# Altium schematic sheet Drive.SchDoc
size 420 x 297 mm; DocumentNumber: 2; SheetNumber: 2; SheetTotal: 6; PageSetup: Record=PageOptions|CenterHorizontal=True|CenterVertical=True|PrintScale=0.96|XCorrection=1.00|YCorrection=1.00|PrintKind=1|BorderSize=5000000|LeftOffset=0|BottomOffset=0|Orientation=2|PaperLength=4318|PaperWidth=2794|Scale=100|PaperSource=7|PrintQuality=600|MediaType=1|DitherType=10|PaperKind=11" x 17"|PrintScaleMode=1
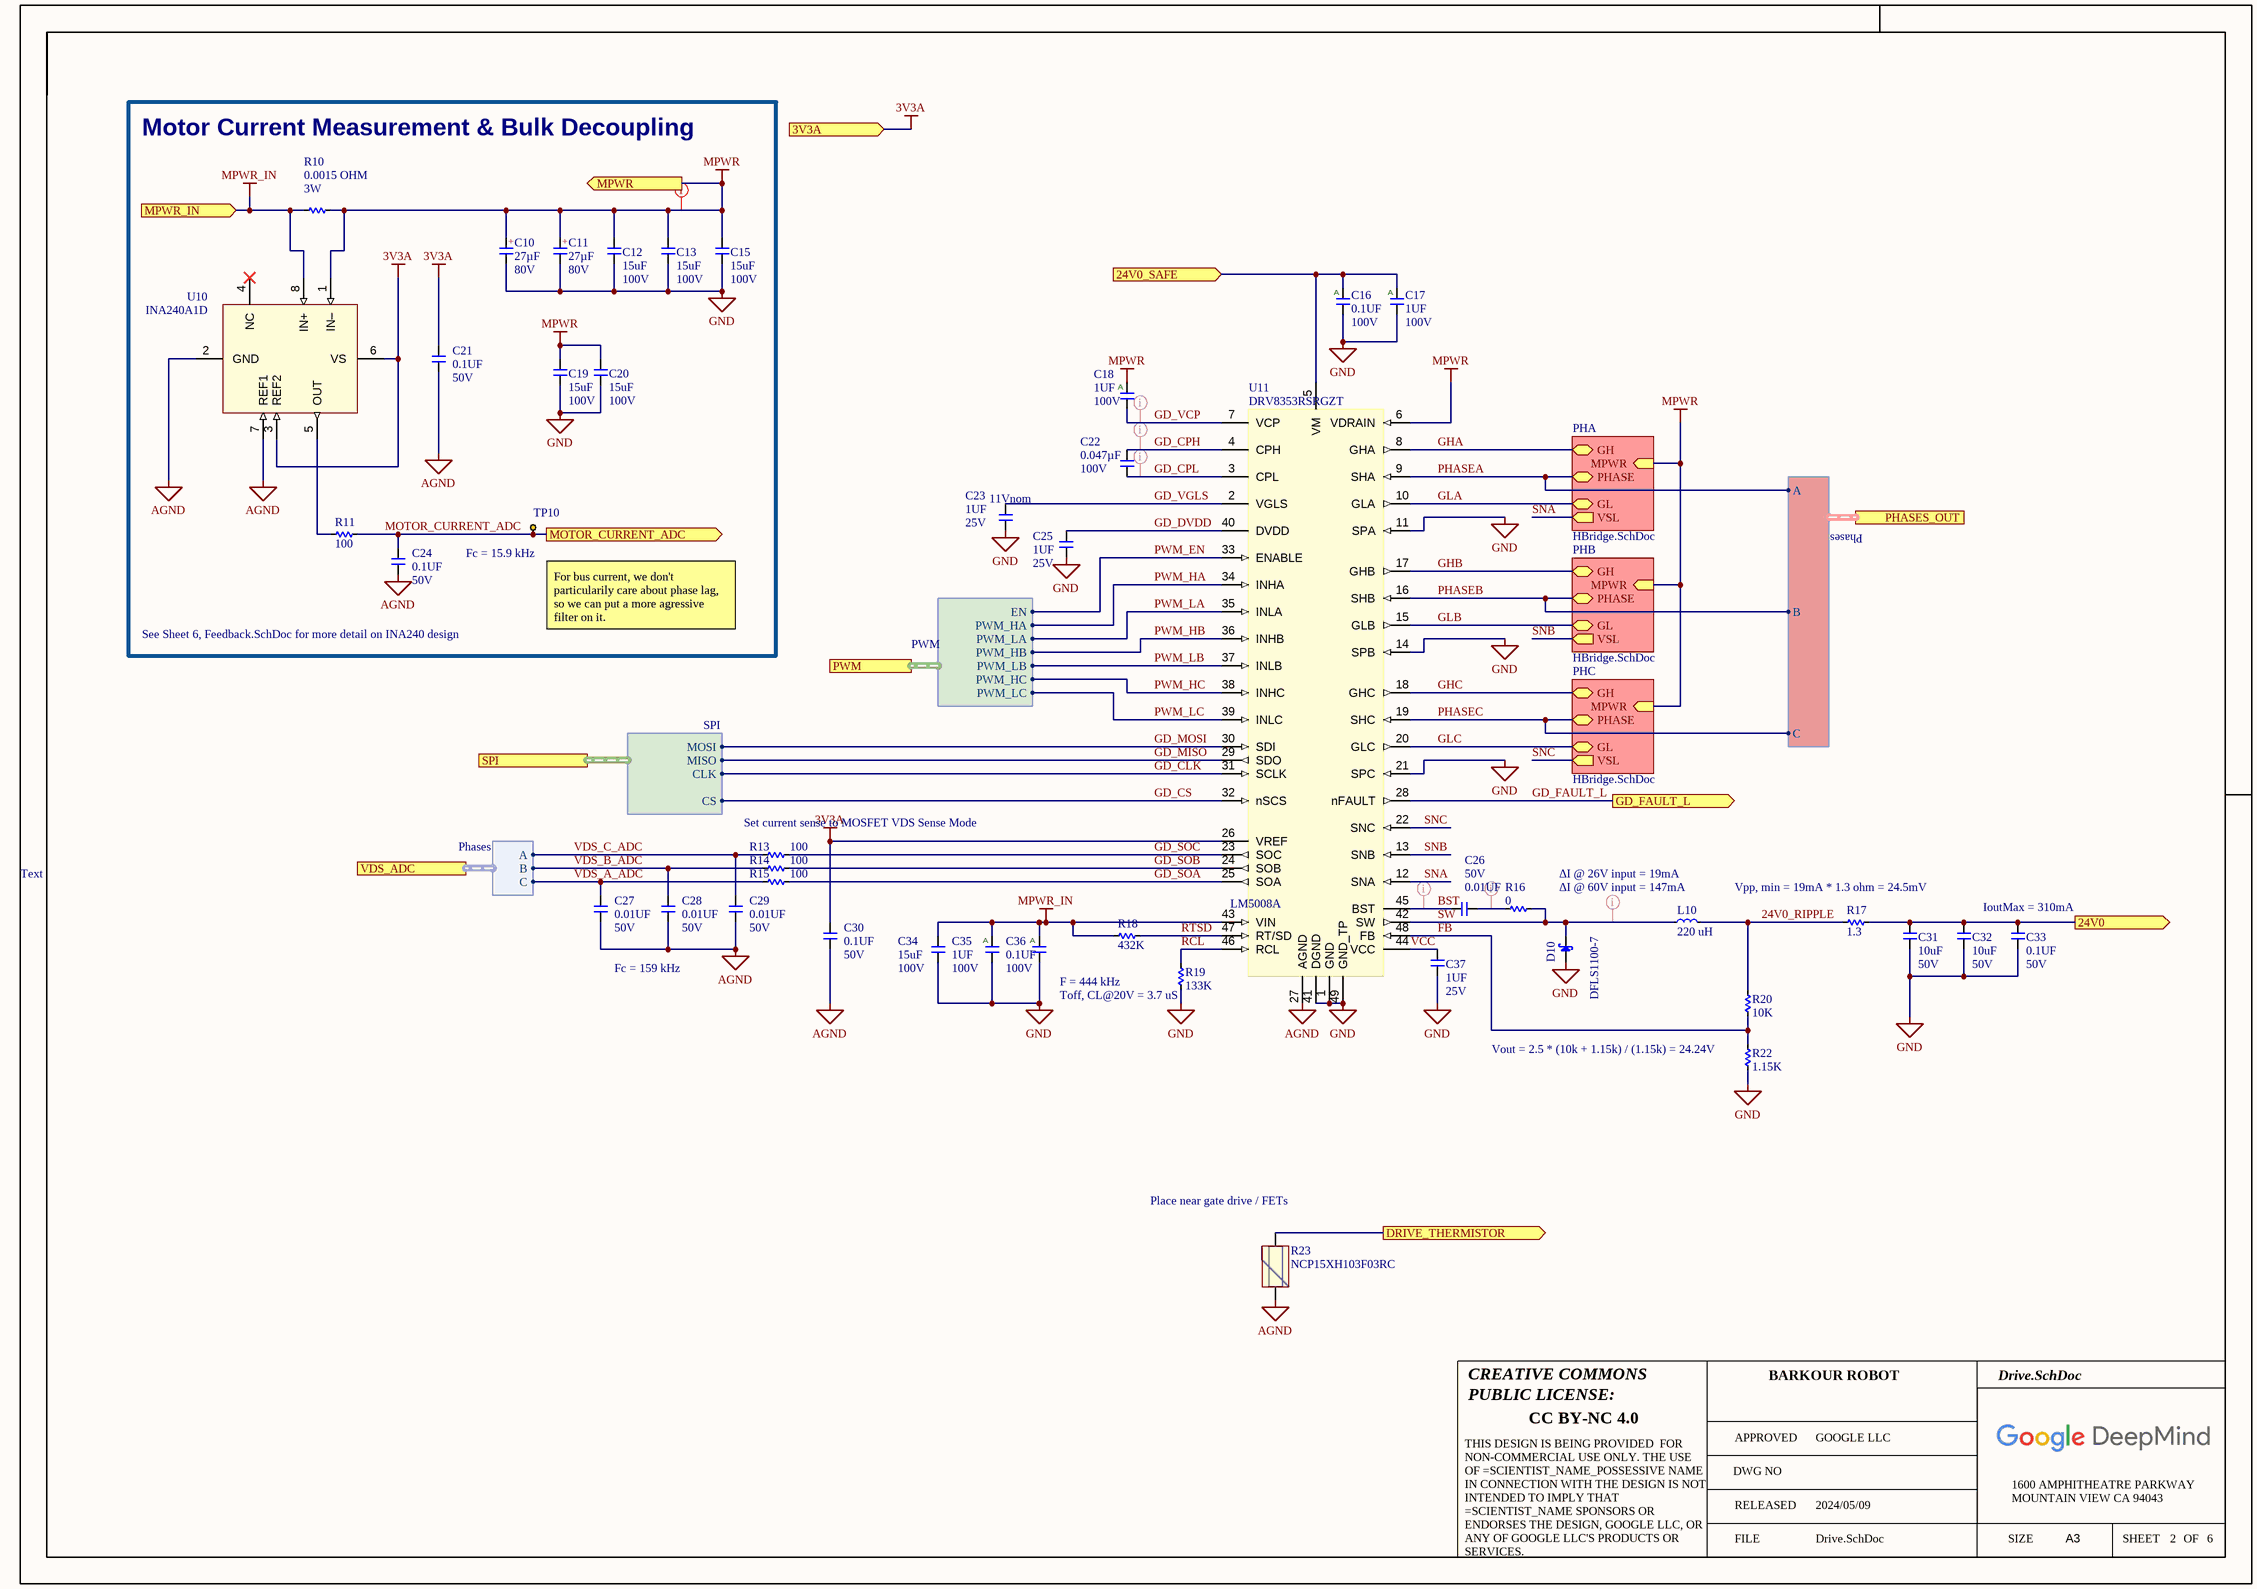
[diagram p0: Drive.SchDoc]

## Parts
C10  value 27µF  Voltage Rating: 80V  [WURTH_WCAP-PTHR_10x12.5x5]  (hidden comment: WURTH 870056175004)
C11  value 27µF  Voltage Rating: 80V  [WURTH_WCAP-PTHR_10x12.5x5]  (hidden comment: WURTH 870056175004)
C12  value 15uF  Voltage: 100V  [C2220]  (hidden comment: __Template_Cap)
C13  value 15uF  Voltage: 100V  [C2220]  (hidden comment: __Template_Cap)
C15  value 15uF  Voltage: 100V  [C2220]  (hidden comment: __Template_Cap)
C16  value 0.1UF  Voltage: 100V  [C0603]  (hidden comment: __Template_Cap_Auto)
C17  value 1UF  Voltage: 100V  [C0805]  (hidden comment: __Template_Cap_Auto)
C18  value 1UF  Voltage: 100V  [C0805]  (hidden comment: __Template_Cap_Auto)
C19  value 15uF  Voltage: 100V  [C2220]  (hidden comment: __Template_Cap)
C20  value 15uF  Voltage: 100V  [C2220]  (hidden comment: __Template_Cap)
C21  value 0.1UF  Voltage: 50V  [C0402]  (hidden comment: __Template_Cap)
C22  value 0.047µF  Voltage: 100V  [C0603Y]  (hidden comment: __Template_Cap)
C23  value 1UF  Voltage: 25V  [C0402]  (hidden comment: __Template_Cap)
C24  value 0.1UF  Voltage: 50V  [C0402]  (hidden comment: __Template_Cap)
C25  value 1UF  Voltage: 25V  [C0402]  (hidden comment: __Template_Cap)
C26  value 0.01UF  Voltage: 50V  [C0402]  (hidden comment: __Template_Cap)
C27  value 0.01UF  Voltage: 50V  [C0402]  (hidden comment: __Template_Cap)
C28  value 0.01UF  Voltage: 50V  [C0402]  (hidden comment: __Template_Cap)
C29  value 0.01UF  Voltage: 50V  [C0402]  (hidden comment: __Template_Cap)
C30  value 0.1UF  Voltage: 50V  [C0402]  (hidden comment: __Template_Cap)
C31  value 10uF  Voltage: 50V  [C1210_H2.7mm]  (hidden comment: __Template_Cap)
C32  value 10uF  Voltage: 50V  [C1210_H2.7mm]  (hidden comment: __Template_Cap)
C33  value 0.1UF  Voltage: 50V  [C0402]  (hidden comment: __Template_Cap)
C34  value 15uF  Voltage: 100V  [C2220]  (hidden comment: __Template_Cap)
C35  value 1UF  Voltage: 100V  [C0805]  (hidden comment: __Template_Cap_Auto)
C36  value 0.1UF  Voltage: 100V  [C0603]  (hidden comment: __Template_Cap_Auto)
C37  value 1UF  Voltage: 25V  [C0402]  (hidden comment: __Template_Cap)
D10  value DFLS1100-7  [POWERDI123_DFLS1100-7]  (hidden comment: __Template_Diode_Schottky_A/K)
L10  value 220 uH  [IND_MSS7348]  (hidden comment: __Template_Inductor)
R10  value 0.0015 OHM  Power: 3W  [R2512_H0.8MM]
R11  value 100  [R0402]
R13  value 100  [R0402]
R14  value 100  [R0402]
R15  value 100  [R0402]
R16  value 0  [R0402]
R17  value 1.3  [R0805]
R18  value 432K  [R0402]
R19  value 133K  [R0402]
R20  value 10K  [R0402]
R22  value 1.15K  [R0402]
R23  Mfg P/N: NCP15XH103F03RC  [R0402_H0.55MM]  (hidden comment: __Template_Thermistor)
TP10  TEST_KEYSTONE5015  [TP_KEYSTONE_5015]  (value not drawn)
U10  INA240A1D  [TI SOIC-8 D0008A]
U11  MFG P/N: DRV8353RSRGZT  [VQFN50P700X700X100-48-TP_TP-CUST_NO_VIAS]  (hidden comment: MOTOR_DRIVE_DRV8353RSRGZT)

## Blocks framed on the sheet
Motor Current Measurement & Bulk Decoupling: C10-C13 C15 C19-C21 C24 R10 R11 TP10 U10

## Sub-sheets
PHA = HBridge.SchDoc: GL (bidir), GH (bidir), PHASE (bidir), MPWR (in), VSL (out)
PHB = HBridge.SchDoc: GL (bidir), GH (bidir), PHASE (bidir), MPWR (in), VSL (out)
PHC = HBridge.SchDoc: GL (bidir), GH (bidir), PHASE (bidir), MPWR (in), VSL (out)

## Ports
3V3A (in), 24V0 (out), 24V0_SAFE (in), DRIVE_THERMISTOR (out), GD_FAULT_L (out), MOTOR_CURRENT_ADC (out), MPWR (out), MPWR_IN (in), PHASES_OUT (harness Phases), PWM (harness PWM), SPI (harness SPI), VDS_ADC (harness Phases)

## Harnesses
Phases: A, B, C
SPI: CLK, CS, MOSI, MISO
PWM: EN, PWM_HA, PWM_LA, PWM_HB, PWM_LB, PWM_HC, PWM_LC

## Nets
3V3A: C21.1 C30.1 U10.3(REF2) U10.6(VS) U11.26(VREF) ; port 3V3A
AGND: C21.2 C24.2 C27.2 C28.2 C29.2 C30.2 R23.2 U10.2(GND) U10.7(REF1) U11.27(AGND)
GND: C10.2 C11.2 C12.2 C13.2 C15.2 C16.2 C17.2 C19.2 C20.2 C23.2 C25.2 C31.2 C32.2 C33.2 C34.2 C35.2 C36.2 C37.2 D10.A R19.1 R22.1 U11.1(GND) U11.11(SPA) U11.14(SPB) U11.21(SPC) U11.41(DGND) U11.49(GND_TP)
MPWR: C10.1 C11.1 C12.1 C13.1 C15.1 C18.1 C19.1 C20.1 R10.2 U10.1(IN–) U11.6(VDRAIN) ; port MPWR, sheet PHA/MPWR, sheet PHB/MPWR, sheet PHC/MPWR
MPWR_IN: C34.1 C35.1 C36.1 R10.1 R18.1 U10.8(IN+) U11.43(VIN) ; port MPWR_IN
24V0: C31.1 C32.1 C33.1 R17.2 ; port 24V0
24V0_RIPPLE: L10.2 R17.1 R20.2
24V0_SAFE: C16.1 C17.1 U11.5(VM) ; port 24V0_SAFE
BST: C26.1 U11.45(BST)
DRIVE_THERMISTOR: R23.1 ; port DRIVE_THERMISTOR
FB: R20.1 R22.2 U11.48(FB)
GD_CLK: U11.31(SCLK) ; port SPI.CLK
GD_CPH: C22.1 U11.4(CPH)
GD_CPL: C22.2 U11.3(CPL)
GD_CS: U11.32(nSCS) ; port SPI.CS
GD_DVDD: C25.1 U11.40(DVDD)
GD_FAULT_L: U11.28(nFAULT) ; port GD_FAULT_L
GD_MISO: U11.29(SDO) ; port SPI.MISO
GD_MOSI: U11.30(SDI) ; port SPI.MOSI
GD_SOA: R15.2 U11.25(SOA)
GD_SOB: R14.2 U11.24(SOB)
GD_SOC: R13.2 U11.23(SOC)
GD_VCP: C18.2 U11.7(VCP)
GD_VGLS: C23.1 U11.2(VGLS)
GHA: U11.8(GHA) ; sheet PHA/GH
GHB: U11.17(GHB) ; sheet PHB/GH
GHC: U11.18(GHC) ; sheet PHC/GH
GLA: U11.10(GLA) ; sheet PHA/GL
GLB: U11.15(GLB) ; sheet PHB/GL
GLC: U11.20(GLC) ; sheet PHC/GL
MOTOR_CURRENT_ADC: C24.1 R11.2 TP10.1 ; port MOTOR_CURRENT_ADC
PHASEA: U11.9(SHA) ; sheet PHA/PHASE, port PHASES_OUT.A
PHASEB: U11.16(SHB) ; sheet PHB/PHASE, port PHASES_OUT.B
PHASEC: U11.19(SHC) ; sheet PHC/PHASE, port PHASES_OUT.C
PWM_EN: U11.33(ENABLE) ; port PWM.EN
PWM_HA: U11.34(INHA) ; port PWM.PWM_HA
PWM_HB: U11.36(INHB) ; port PWM.PWM_HB
PWM_HC: U11.38(INHC) ; port PWM.PWM_HC
PWM_LA: U11.35(INLA) ; port PWM.PWM_LA
PWM_LB: U11.37(INLB) ; port PWM.PWM_LB
PWM_LC: U11.39(INLC) ; port PWM.PWM_LC
RCL: R19.2 U11.46(RCL)
RTSD: R18.2 U11.47(RT/SD)
SNA: U11.12(SNA) ; sheet PHA/VSL
SNB: U11.13(SNB) ; sheet PHB/VSL
SNC: U11.22(SNC) ; sheet PHC/VSL
SW: D10.K L10.1 R16.2 U11.42(SW)
VCC: C37.1 U11.44(VCC)
VDS_A_ADC: C27.1 R15.1 ; port VDS_ADC.C
VDS_B_ADC: C28.1 R14.1 ; port VDS_ADC.B
VDS_C_ADC: C29.1 R13.1 ; port VDS_ADC.A
NetC26_2: C26.2 R16.1
NetR11_1: R11.1 U10.5(OUT)

Not connected (* = marked no-connect by the designer): U10 4(NC)*

## Layout directives
net class HVSW: BST, GD_CPH, GD_CPL, GD_VCP, NetC26_2, SW
net class HV: MPWR

## Notes on the sheet
- 11Vnom
- (near TP10) Fc = 15.9 kHz
- See Sheet 6, Feedback.SchDoc for more detail on INA240 design
- (near TP10) For bus current, we don't particularily care about phase lag, so we can put a more agressive filter on it.
- (near U11) Set current sense to MOSFET VDS Sense Mode
- Text
- (near U11) LM5008A
- ΔI @ 26V input = 19mA
- ΔI @ 60V input = 147mA
- Vpp, min = 19mA * 1.3 ohm = 24.5mV
- IoutMax = 310mA
- Fc = 159 kHz
- F = 444 kHz
- (near R19) Toff, CL@20V = 3.7 uS
- (near R22) Vout = 2.5 * (10k + 1.15k) / (1.15k) = 24.24V
- (near R23) Place near gate drive / FETs
- CREATIVE COMMONS
- PUBLIC LICENSE:
- BARKOUR ROBOT
- CC BY-NC 4.0
- APPROVED
- DWG NO
- GOOGLE LLC
- FILE
- RELEASED
- 2024/05/09
- SIZE
- 1600 AMPHITHEATRE PARKWAY
- MOUNTAIN VIEW CA 94043
- A3
- SHEET
- OF
- THIS DESIGN IS BEING PROVIDED  FOR NON-COMMERCIAL USE ONLY. THE USE OF =SCIENTIST_NAME_POSSESSIVE NAME IN CONNECTION WITH THE DESIGN IS NOT INTENDED TO IMPLY THAT =SCIENTIST_NAME SPONSORS OR ENDORSES THE DESIGN, GOOGLE LLC, OR ANY OF GOOGLE LLC'S PRODUCTS OR SERVICES.
- (in symbol 1039) A
- (in symbol 1093) A
- (in symbol 31291c97-b9eb-436f-b2ee-2be21f893d37) +

## Library data of the parts
C10 C11 = 31291c97-b9eb-436f-b2ee-2be21f893d37: WCAP-PTHR ALUMINUM POLYMER CAP; Manufacturer: Wurth Electronics; Grade: Commercial; Tolerance: 0.2; ComponentId: 31291c97-b9eb-436f-b2ee-2be21f893d37; Manufacturer Part Number: 870056175004; Package: Cap, Radial, Thru-Hole; ComponentLink1Description: Datasheet; ComponentLink1URL: https://katalog.we-online.de/pbs/datasheet/870056175004.pdf; Category: Polymer Capacitors; Status: Preliminary; Operating Temperature: -55 °C ~ 105 °C
C12 C13 C15 C19 C20 C34 = 207: CAP, CER, X7S, 15uF, 100V, 20%, 2220, 2.8mm T; ID: 207; MFG: TDK; MFG P/N: C5750X7S2A156M250KB; XPN: 150-00255-00; Status: Released; Package: 2220; Dielectric: X7S; Tolerance: 20%; Height: 2.8mm T; ComponentLink1Description: Datasheet; COMMON: 150-00255-00
C16 C36 = 1039: CAP, CER, X7S, 0.1uF, 100V, 10%, 0603, AUTOGRADE; ID: 1039; MFG: TDK; MFG P/N: CGA3E3X7S2A104K080AB; Dielectric: X7R; XPN: 150-00222-00; PROXY: 150-03755-00; Gecko: 150-04433-00; EES: 150-04577-00; Status: Released; Package: 0603; Tolerance: 10%; Height: 0.9mm T; ComponentLink1Description: Datasheet; COMMON: 150-00222-00; LOON: 150-00222-00
C17 C18 C35 = 1093: CAP, CER, X7S, 1uF, 20%, 100V, 0805; ID: 1093; MFG: TDK; MFG P/N: CGA4J3X7S2A105M125AE; XPN: XS-10001040; COMMON: 150-01093-00; PROXY: 150-03473-00; EES: 150-04579-00; Status: Released; Package: 0805; Dielectric: X7S; Tolerance: 20%; Height: 1.5mm T; ComponentLink1Description: Datasheet; LOON: 150-01093-00; Gecko: 150-01093-00
C21 C24 C30 C33 = 1762: CAP, CER, X5R, 0.1uF, 10%, 50V, 0402, 0.55mm; ID: 1762; MFG: YAGEO; MFG P/N: CC0402KRX5R9BB104; EPIC: G150-02449-00; EES: 150-04581-00; Status: Released; Package: 0402; Dielectric: X5R; Tolerance: 10%; Height: 0.55mm; Supplier 1: Digi-Key; HelpURL: https://www.digikey.com/product-detail/en/yageo/CC0402KRX5R9BB104/311-3342-1-ND/6818312; ComponentLink1Description: Datasheet; ComponentLink1URL: http://www.yageo.com/documents/recent/UPY-GPHC_X5R_4V-to-50V_25.pdf; Supplier Part Number 1: 311-3342-1-ND
C22 = 1838: CAP, CER, X7R, 0.047uF, 100V, 10%, 0603, AUTOGRADE; ID: 1838; MFG: Samsung Electro-Mechanics; MFG P/N: CL10B473KC8WPNC; EES: 150-04561-00; Status: Released; Package: 0603; Dielectric: X7R; Tolerance: 10%; Height: 0.9mm; Supplier 1: Digi-Key; HelpURL: https://www.digikey.com/product-detail/en/samsung-electro-mechanics/CL10B473KC8WPNC/1276-6984-1-ND/7320626; ComponentLink1Description: Datasheet; ComponentLink1URL: https://www.samsungsem.com/resources/file/global/support/product_catalog/MLCC.pdf; Supplier Part Number 1: 1276-6984-1-ND
C23 C25 C37 = 1717: CAP, CER, X5R, 1uF, 10%, 25V, 0402; ID: 1717; MFG: TDK; MFG P/N: C1005X5R1E105K050BC; COMMON: 150-01202-00; PROXY: 150-03358-00; EES: 150-04580-00; Status: Released; Package: 0402; Dielectric: X5R; Tolerance: 10%; Height: 0.56mm; Supplier 1: Digi-Key; HelpURL: https://www.digikey.in/product-detail/en/tdk-corporation/C1005X5R1E105K050BC/445-9066-1-ND/3648637; ComponentLink1Description: Datasheet; ComponentLink1URL: https://product.tdk.com/info/en/catalog/datasheets/mlcc_commercial_general_en.pdf; Supplier Part Number 1: 445-9066-1-ND
C26-C29 = 625: CAP, CER, X7R, 0.01uF, 50V, 20%, 0402, 0.56mm T; ID: 625; MFG: KEMET; MFG P/N: C0402C103M5RACTU; XPN: 150-00227-00; EES: 150-04592-00; Status: Released; Package: 0402; Dielectric: X7R; Tolerance: 20%; Height: 0.56mm T; ComponentLink1Description: Datasheet; COMMON: 150-00227-00; LOON: 150-00227-00; Gecko: 150-00227-00
C31 C32 = 1813: CAP, CER, X5R, 10uF, 50V, 20%, 1210; ID: 1813; MFG: TAIYO YUDEN; MFG P/N: UMK325BJ106MM-T; Gecko: 150-04488-00; EES: 150-04569-00; Status: Released; Package: 1210; Dielectric: X5R; Tolerance: 20%; Height: 2.7mm; Supplier 1: Digi-Key; HelpURL: https://www.digikey.com/product-detail/en/taiyo-yuden/UMK325BJ106MM-T/587-2225-1-ND/2002923; ComponentLink1Description: Datasheet; ComponentLink1URL: https://media.digikey.com/pdf/Data%20Sheets/Taiyo%20Yuden%20PDFs%20URL%20links/UMK325BJ106MM-T_Spec.pdf; Supplier Part Number 1: 587-2225-1-ND
D10 = 203: DIODE, SCHOTTKY, 100V, 1A, POWERDI123; ID: 203; MFG: Diodes Incorporated; Voltage – Forward (VF) (MAX) @ IF: 770mV @ 1A; Current - Reverse Leakage @ VR: 1µA @ 100V; PROXY: 480-01332-00; EES: 480-01752-00; Status: Released; MFG P/N: DFLS1100-7; Package: POWERDI®123; Category: Diode; RoHS Compliant: Yes; Diode Type: Schottky; Mounting Type: SMD; Voltage - DC Reverse (VR) (MAX): 100V; Current - Average Rectified (IO): 1A; Operating Temperature – Junction: -55°C ~ 175°C; Supplier 1: Digi-Key; HelpURL: https://www.digikey.in/product-detail/en/diodes-incorporated/DFLS1100-7/DFLS1100DICT-ND/765634?utm_adgroup=Semiconductor+Modules&mkwid=sEPp89yZo&pcrid=217293262460&pkw=&pmt=b&pdv=c&productid=&&gclid=EAIaIQobChMI07vviJLx3AIVWBiPCh384A5OEAAYAyAAEgIdtPD_BwE; ComponentLink1Description: Datasheet; ComponentLink1URL: https://www.diodes.com/assets/Datasheets/ds30497.pdf; Supplier Part Number 1: DFLS1100DICT-ND
L10 = 938: IND, WIREWOUND, SHIELDED, 220uH, 0.74A, 20%, DCR 0.624, SMD, AUTOGRADE; ID: 938; Catagory: Fixed Inductors; MFG: Coilcraft; MFG P/N: MSS7348-224ME_; Rdc max: 624 mOhms; Idc max: 740 mA; EES: 180-02231-00; ComponentLink1Description: Datasheet; Status: Released; Package: 2 - pin SMD; Tolerance: 20%; Supplier 1: Mouser; HelpURL: https://www.mouser.in/ProductDetail/Coilcraft/MSS7348-224MEB?qs=0gpYmj5HUPI60pjVHs4RmA%3D%3D; ComponentLink1URL: https://www.coilcraft.com/en-us/products/power/shielded-inductors/ferrite-drum/mss-mos/mss7348/#; Height: 4.8mm; Supplier Part Number 1: 994-MSS7348-224MEB
R10 = 9999: RES, 0.0015, 1%, 3W, 2512; ID: 9999; MFG: TE Connectivity Passive Product; MFG P/N: TLR3A30DR0015FTDG; Catagory: Chip Resistor - Surface Mount; EES: 470-17948-00; Status: Released; Package: 2512; Tolerance: 1%; Height: 0.8mm; Supplier 1: Digi-Key; HelpURL: https://www.digikey.com/product-detail/en/te-connectivity-passive-product/TLR3A30DR0015FTDG/A131795CT-ND/8603925; ComponentLink1Description: Datasheet; ComponentLink1URL: https://www.te.com/commerce/DocumentDelivery/DDEController?Action=srchrtrv&DocNm=1773449-3&DocType=DS&DocLang=English; Supplier Part Number 1: A131795CT-ND
R11 R13-R15 = 7286: RES, 100, 1%, 1/10W, 0402, AUTO GRADE; ID: 7286; MFG: PANASONIC; MFG P/N: ERJ2RKF1000X; COMMON: 470-00294-00; PROXY: Use ID #8481; Status: Released; Package: 0402; Power: 1/10W; Tolerance: 1%; XPN: 470-00294-00
R16 = 8004: RES, 0, JUMPER, 1/16W, 0402; ID: 8004; MFG: YAGEO; MFG P/N: RC0402FR-070RL; COMMON: 470-02332-00; PROXY: Use ID #2; Gecko: 470-17892-00; Status: Released; Package: 0402; Power: 1/16W; Tolerance: JUMPER; XPN: 470-02332-00
R17 = 8516: RES, 1.3, 1%, 1/2W, AUTOGRADE, 0805; ID: 8516; MFG: Panasonic Electronic Components; MFG P/N: ERJ-6DQF1R3V; Catagory: Resistor; Status: Released; Package: 0805; Power: 1/2W; Tolerance: 1%; Height: 0.70mm; Supplier 1: Digi-Key; HelpURL: https://www.digikey.in/product-detail/en/panasonic-electronic-components/ERJ-6DQF1R3V/P19271CT-ND/6004626; ComponentLink1Description: Datasheet; ComponentLink1URL: https://industrial.panasonic.com/cdbs/www-data/pdf/RDN0000/AOA0000C313.pdf; Supplier Part Number 1: P19271CT-ND
R18 = 8801: RES, 432K, 1%, 1/16W, 0402; ID: 8801; MFG: VISHAY; MFG P/N: CRCW0402432KFKED; PROXY: Use ID #9276; Status: Released; Package: 0402; Power: 1/16W; Tolerance: 1%; Height: 0.45mm; Supplier 1: Digi-Key; HelpURL: https://www.digikey.com/products/en?keywords=CRCW0402432KFKED; ComponentLink1Description: Datasheet; ComponentLink1URL: http://www.vishay.com/docs/28773/crcwce3.pdf
R19 = 5074: RES, 133K, 1%, 1/16W, 0402, AUTOGRADE; ID: 5074; MFG: VISHAY; MFG P/N: CRCW0402133KFKED; COMMON: 470-02579-00; PROXY: Use ID #9237; Gecko: 470-17712-00; XPN: XS-10013881; Orbital: 470-18085-00; Status: Released; Package: 0402; Power: 1/16W; Tolerance: 1%; Height: 0.40mm; Supplier 1: Digi-Key; Supplier Part Number 1: 541-133KLCT-ND
R20 = 7216: RES, 10K, 1%, 1/10W, 0402, AUTOGRADE; ID: 7216; MFG: PANASONIC; MFG P/N: ERJ2RKF1002X; COMMON: 470-00319-00; Gecko: 470-17736-00; Status: Released; Package: 0402; Power: 1/10W; Tolerance: 1%; XPN: 470-00319-00
R22 = 8684: RES, 1.15K, 1%, 1/16W, 0402; ID: 8684; MFG: VISHAY; MFG P/N: CRCW04021K15FKED; PROXY: Use ID #9098; Status: Released; Package: 0402; Power: 1/16W; Tolerance: 1%; Height: 0.45mm; Supplier 1: Digi-Key; HelpURL: https://www.digikey.com/products/en?keywords=CRCW04021K15FKED; ComponentLink1Description: Datasheet; ComponentLink1URL: http://www.vishay.com/docs/28773/crcwce3.pdf
R23 = 175: SENSOR, THERMISTOR, NTC, 10K, 1%, 3380K, 100mW, 0402; ID: 175; Mfg: Murata Electronics; SENSOR TYPE: THERMISTOR NTC; EES: 550-00601-00; Status: Released; Package: 0402; Category: Sensors; RoHS Compliant: Yes; Mounting Type: Surface Mount; Supplier 1: Digi-Key; HEIGHT (MAX): 0.55mm; OPERATING TEMPERATURE: -40°C ~ 125°C; HelpURL: https://www.digikey.com/product-detail/en/murata-electronics/NCP15XH103F03RC/490-4801-1-ND/1644682; ComponentLink1Description: Datasheet; ComponentLink1URL: https://www.murata.com/en-us/api/pdfdownloadapi?cate=&partno=NCP15XH103F03RC; Height: 0.55mm; Supplier Part Number 1: 490-4801-1-ND
TP10 = TEST_KEYSTONE5015: PC TEST POINT MINIATURE SMT; Manufacturer: Keystone Electronics; Manufacturer Part Number: 5015; Part Number: 250-00207-00; Supplier 1: Digi-Key; RoHS: RoHS Compliant; Category: Test and Measurement; Stock 1: 1322985; Pricing 1: 1=0.44, 10=0.413, 50=0.301, 100=0.2891, 250=0.25964, 500=0.24784 (USD); Type: PC Test Point, Miniature; Terminal: 0.010" (0.25mm) Phosphor Bronze, Silver Plate; Mounting Type: Surface Mount; Material: Phosphor Bronze; Color: -; Packaging: Cut Tape (CT); ComponentLink1URL: http://mail.keyelco.com/ENG._DEPT/PDF%20CAT%20NO%20Drawings/5015.pdf; ComponentLink1Description: Datasheet; Supplier Part Number 1: 5015KCT-ND
U10 = INA240A1: Current Sense Amplifiers -4 to 80V, bidirectional, ultra-precise current sense amplifier with enhanced PWM rejection, 20V/V gain; Manufacturer: Texas Instruments; Manufacturer Part Number: INA240A1D; Supplier 1: Digi-Key; Supplier 2: Mouser; Supplier 3: Farnell; Supplier Part Number 1: 296-51172-1-ND; Supplier Part Number 2: 595-INA240A1D; Supplier Part Number 3: 3005359
U11 = 820: IC, MOTOR DRIVER, DRV8353, MULTIPHASE, BLDC, HALF BRIDGE, POWER MOSFET, 6V TO 95V VIN, VQFN-48; ID: 820; MFG: Texas Instruments; EES: 313-05801-00; Status: Released; Package: 48-VQFN (7x7); Category: Integrated Circuits (ICs); RoHS Compliant: Yes; Supplier 1: Digi-Key; HelpURL: https://www.digikey.in/product-detail/en/texas-instruments/DRV8353RSRGZT/296-50273-1-ND/9654095; ComponentLink1Description: Datasheet; ComponentLink1URL: https://www.ti.com/lit/ds/symlink/drv8350.pdf?HQS=TI-null-null-digikeymode-df-pf-null-wwe&ts=1593096373926; Mounting Type: SMD; Height: 1mm; Supplier Part Number 1: 296-50273-1-ND